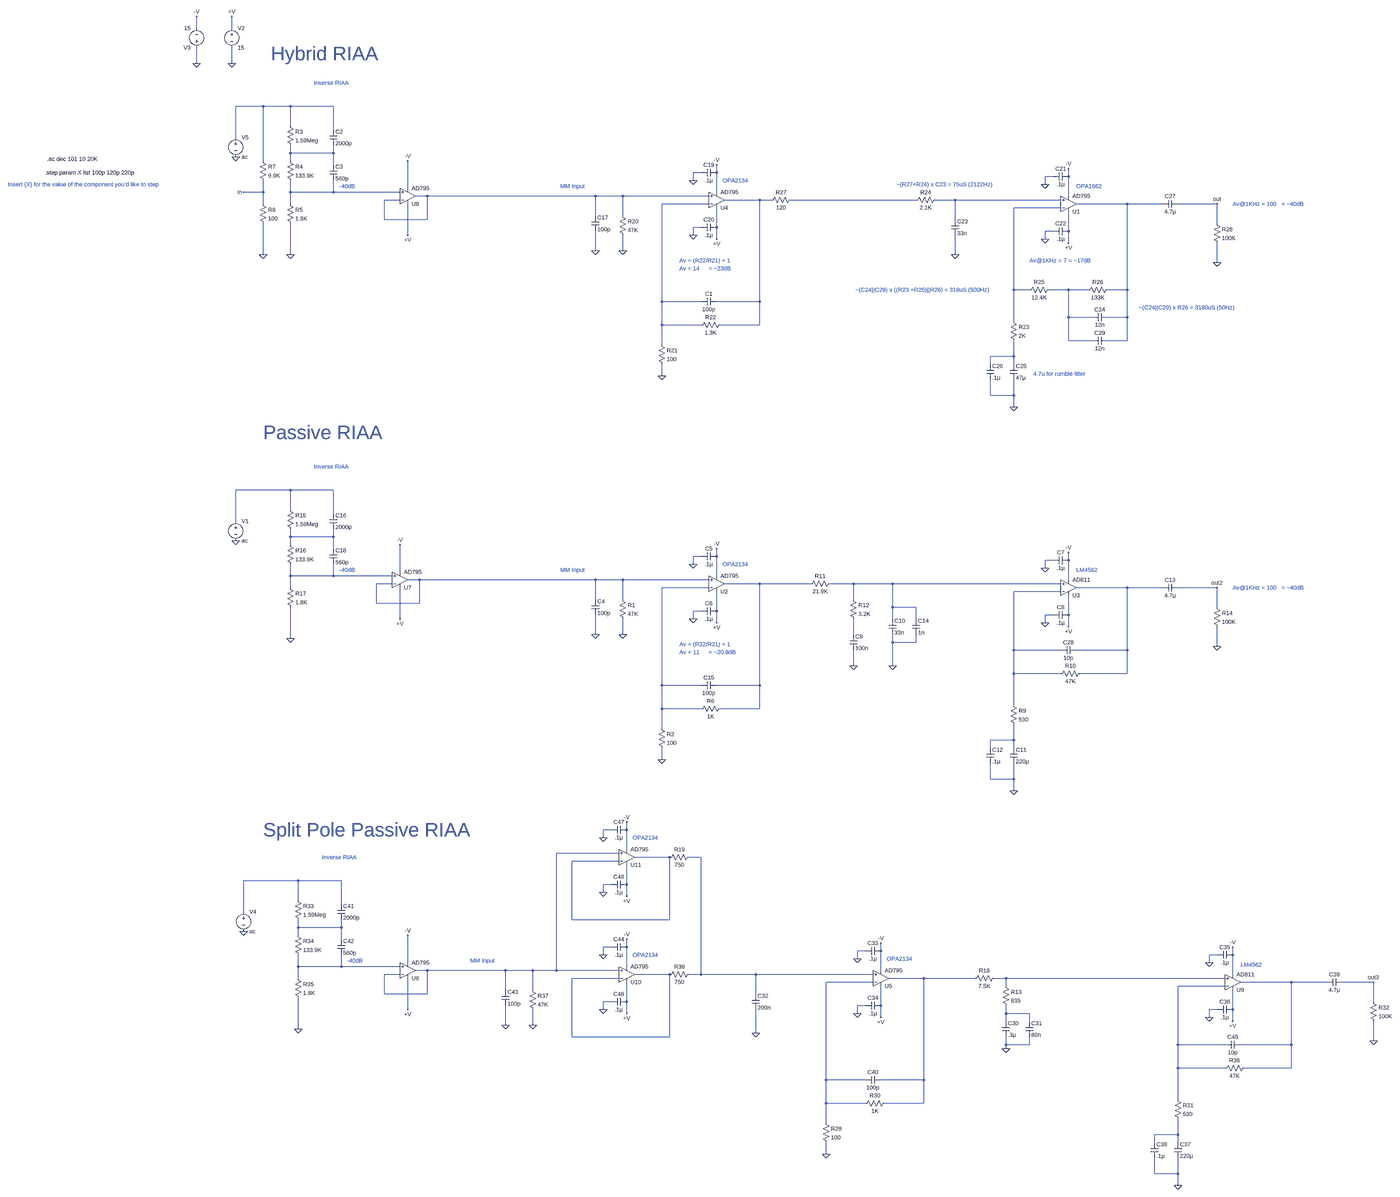
[diagram p0: schematic DIY Phonostage Examples 2.asc, whole sheet]
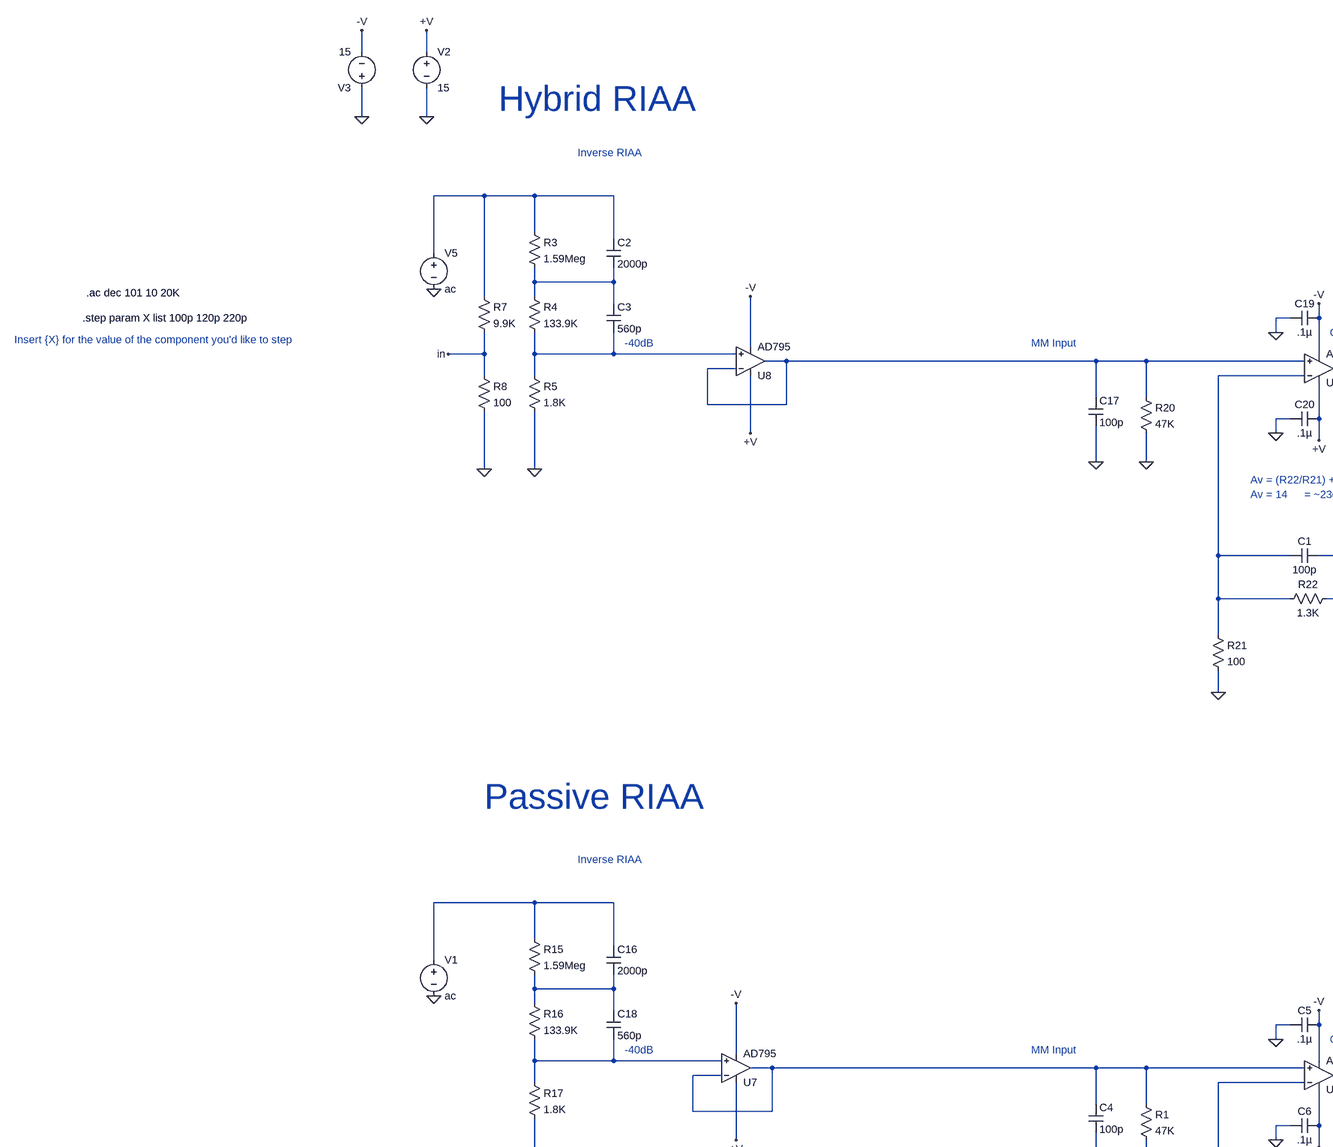
[diagram p1: schematic DIY Phonostage Examples 2.asc, part, row 1 of 2, column 1 of 2]
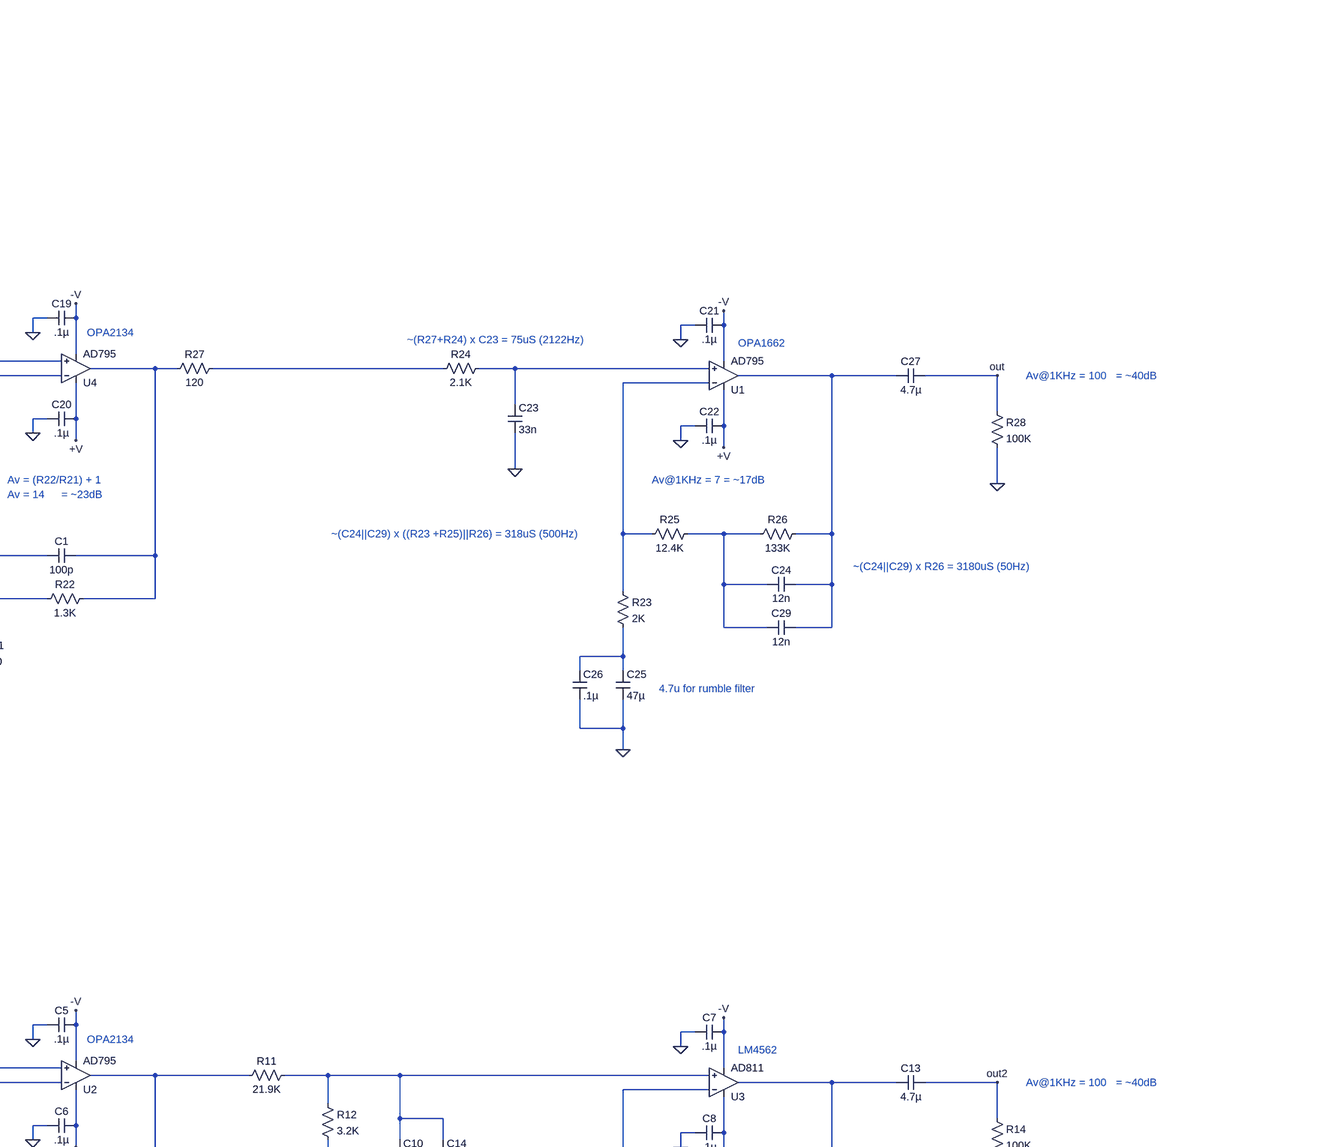
[diagram p2: schematic DIY Phonostage Examples 2.asc, part, row 1 of 2, column 2 of 2]
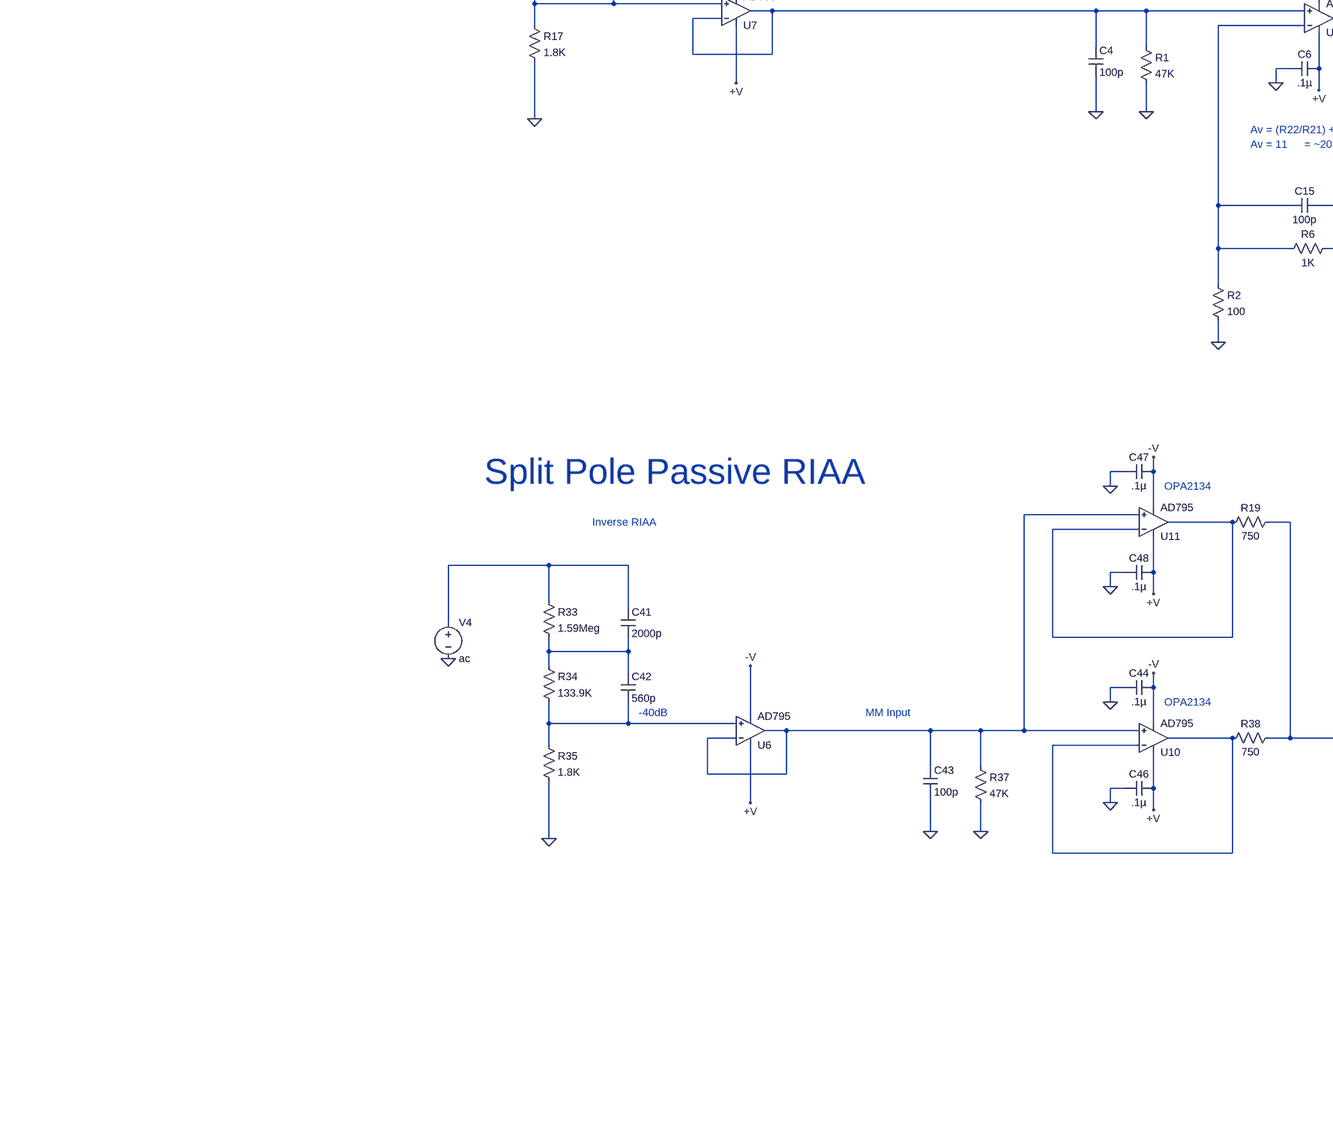
[diagram p3: schematic DIY Phonostage Examples 2.asc, part, row 2 of 2, column 1 of 2]
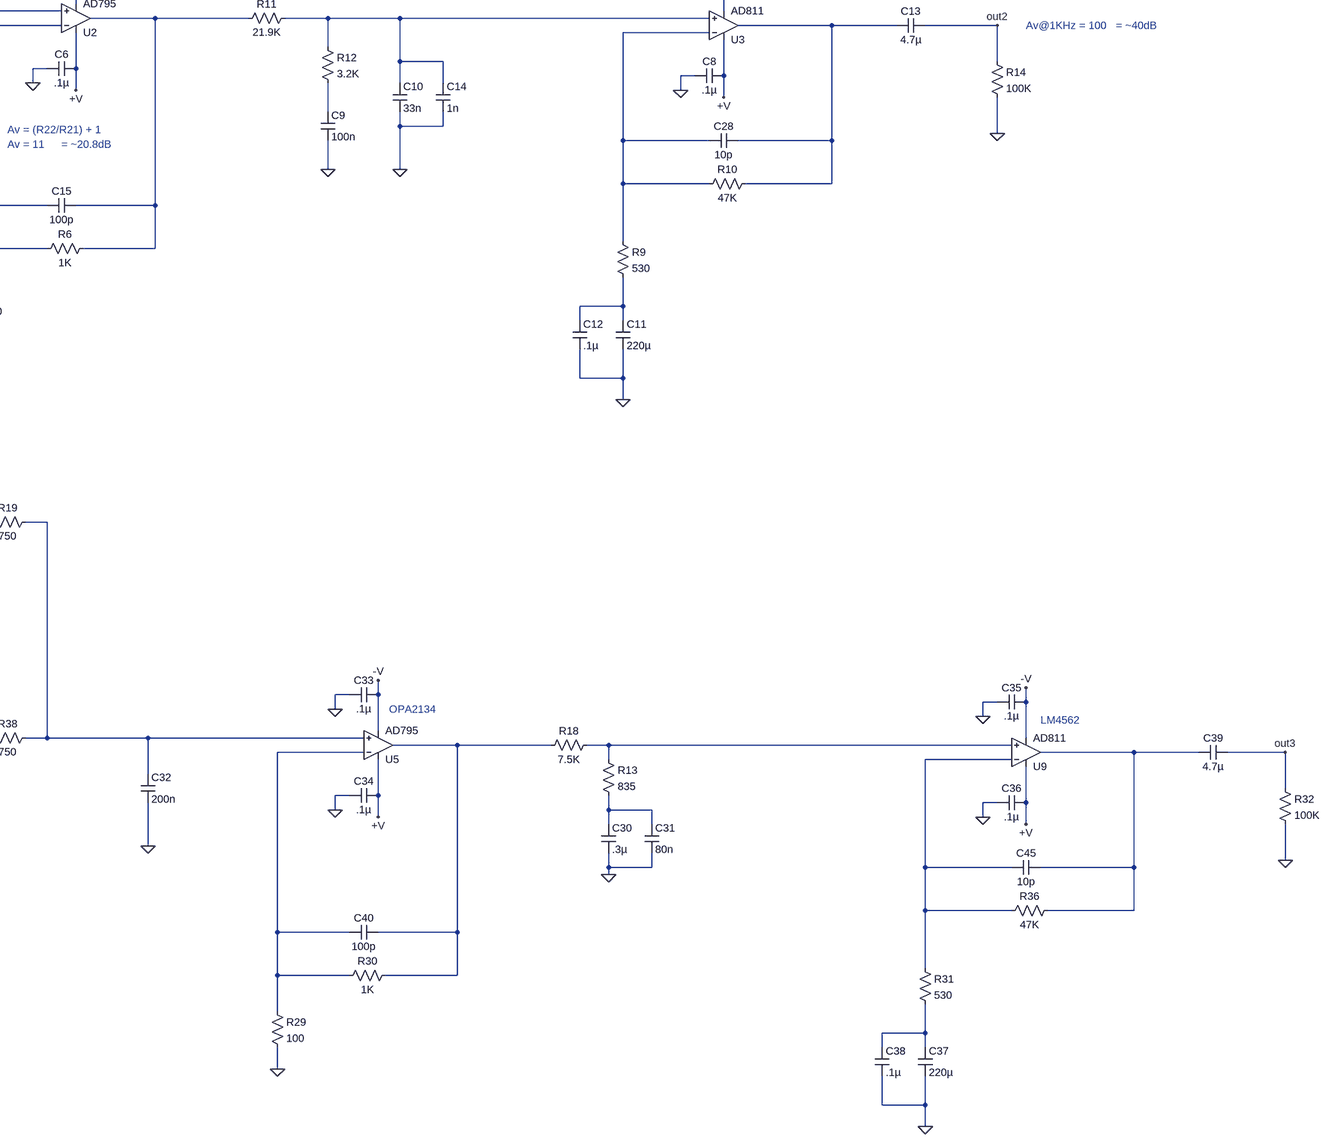
[diagram p4: schematic DIY Phonostage Examples 2.asc, part, row 2 of 2, column 2 of 2]
DIY Phonostage Examples 2.asc, the LTspice schematic file:
Version 4
SHEET 1 5012 5172
WIRE 80 -672 80 -720
WIRE 224 -672 224 -720
WIRE 80 -528 80 -592
WIRE 224 -528 224 -592
WIRE 352 -352 240 -352
WIRE 464 -352 352 -352
WIRE 640 -352 464 -352
WIRE 464 -272 464 -352
WIRE 640 -256 640 -352
WIRE 240 -224 240 -352
WIRE 464 -160 464 -192
WIRE 640 -160 640 -192
WIRE 640 -160 464 -160
WIRE 352 -128 352 -352
WIRE 464 -128 464 -160
WIRE 640 -112 640 -160
WIRE 2144 -80 2112 -80
WIRE 2208 -80 2208 -112
WIRE 3584 -64 3552 -64
WIRE 3648 -64 3648 -96
WIRE 2112 -48 2112 -80
WIRE 3552 -32 3552 -64
WIRE 944 -16 944 -128
WIRE 352 0 352 -48
WIRE 352 0 272 0
WIRE 464 0 464 -48
WIRE 640 0 640 -48
WIRE 640 0 464 0
WIRE 912 0 640 0
WIRE 2208 0 2208 -80
WIRE 1024 16 976 16
WIRE 1712 16 1024 16
WIRE 1824 16 1712 16
WIRE 2176 16 1824 16
WIRE 3648 16 3648 -64
WIRE 912 32 848 32
WIRE 2384 32 2240 32
WIRE 2432 32 2384 32
WIRE 3024 32 2512 32
WIRE 3184 32 3104 32
WIRE 3616 32 3184 32
WIRE 352 48 352 0
WIRE 464 48 464 0
WIRE 2176 48 1984 48
WIRE 3888 48 3680 48
WIRE 4032 48 3888 48
WIRE 4256 48 4096 48
WIRE 3616 64 3424 64
WIRE 1712 96 1712 16
WIRE 1824 96 1824 16
WIRE 848 112 848 32
WIRE 1024 112 1024 16
WIRE 1024 112 848 112
WIRE 3184 112 3184 32
WIRE 4256 128 4256 48
WIRE 2144 144 2112 144
WIRE 2208 144 2208 64
WIRE 3584 160 3552 160
WIRE 3648 160 3648 80
WIRE 944 176 944 48
WIRE 2112 176 2112 144
WIRE 2208 192 2208 144
WIRE 3552 192 3552 160
WIRE 3648 208 3648 160
WIRE 1712 240 1712 160
WIRE 1824 240 1824 176
WIRE 352 256 352 128
WIRE 464 256 464 128
WIRE 3184 256 3184 176
WIRE 4256 288 4256 208
WIRE 3424 400 3424 64
WIRE 3488 400 3424 400
WIRE 3648 400 3568 400
WIRE 3728 400 3648 400
WIRE 3888 400 3888 48
WIRE 3888 400 3808 400
WIRE 1984 448 1984 48
WIRE 2144 448 1984 448
WIRE 2384 448 2384 32
WIRE 2384 448 2208 448
WIRE 3648 512 3648 400
WIRE 3744 512 3648 512
WIRE 3888 512 3888 400
WIRE 3888 512 3808 512
WIRE 3424 528 3424 400
WIRE 1984 544 1984 448
WIRE 2144 544 1984 544
WIRE 2384 544 2384 448
WIRE 2384 544 2224 544
WIRE 3648 608 3648 512
WIRE 3744 608 3648 608
WIRE 3888 608 3888 512
WIRE 3888 608 3808 608
WIRE 1984 624 1984 544
WIRE 3424 672 3424 608
WIRE 3424 672 3328 672
WIRE 3328 704 3328 672
WIRE 3424 704 3424 672
WIRE 1984 752 1984 704
WIRE 3328 832 3328 768
WIRE 3424 832 3424 768
WIRE 3424 832 3328 832
WIRE 3424 880 3424 832
WIRE 464 1248 240 1248
WIRE 640 1248 464 1248
WIRE 464 1328 464 1248
WIRE 640 1344 640 1248
WIRE 240 1376 240 1248
WIRE 464 1440 464 1408
WIRE 640 1440 640 1408
WIRE 640 1440 464 1440
WIRE 464 1472 464 1440
WIRE 640 1488 640 1440
WIRE 2144 1520 2112 1520
WIRE 2208 1520 2208 1488
WIRE 3584 1536 3552 1536
WIRE 3648 1536 3648 1504
WIRE 2112 1552 2112 1520
WIRE 3552 1568 3552 1536
WIRE 912 1584 912 1472
WIRE 464 1600 464 1552
WIRE 640 1600 640 1552
WIRE 640 1600 464 1600
WIRE 880 1600 640 1600
WIRE 2208 1600 2208 1520
WIRE 992 1616 944 1616
WIRE 1712 1616 992 1616
WIRE 1824 1616 1712 1616
WIRE 2176 1616 1824 1616
WIRE 3648 1616 3648 1536
WIRE 880 1632 816 1632
WIRE 2384 1632 2240 1632
WIRE 2592 1632 2384 1632
WIRE 2768 1632 2672 1632
WIRE 2928 1632 2768 1632
WIRE 3616 1632 2928 1632
WIRE 464 1648 464 1600
WIRE 2176 1648 1984 1648
WIRE 3888 1648 3680 1648
WIRE 4032 1648 3888 1648
WIRE 4256 1648 4096 1648
WIRE 3616 1664 3424 1664
WIRE 1712 1696 1712 1616
WIRE 1824 1696 1824 1616
WIRE 2768 1696 2768 1632
WIRE 816 1712 816 1632
WIRE 992 1712 992 1616
WIRE 992 1712 816 1712
WIRE 2928 1728 2928 1632
WIRE 3024 1728 2928 1728
WIRE 4256 1728 4256 1648
WIRE 2144 1744 2112 1744
WIRE 2208 1744 2208 1664
WIRE 3584 1760 3552 1760
WIRE 3648 1760 3648 1680
WIRE 912 1776 912 1648
WIRE 2112 1776 2112 1744
WIRE 2928 1776 2928 1728
WIRE 3024 1776 3024 1728
WIRE 2208 1792 2208 1744
WIRE 3552 1792 3552 1760
WIRE 3648 1808 3648 1760
WIRE 1712 1840 1712 1760
WIRE 1824 1840 1824 1776
WIRE 2768 1840 2768 1776
WIRE 464 1856 464 1728
WIRE 2928 1872 2928 1840
WIRE 3024 1872 3024 1840
WIRE 3024 1872 2928 1872
WIRE 4256 1888 4256 1808
WIRE 3424 1904 3424 1664
WIRE 3616 1904 3424 1904
WIRE 3888 1904 3888 1648
WIRE 3888 1904 3680 1904
WIRE 2768 1968 2768 1904
WIRE 2928 1968 2928 1872
WIRE 3424 2000 3424 1904
WIRE 3616 2000 3424 2000
WIRE 3888 2000 3888 1904
WIRE 3888 2000 3696 2000
WIRE 1984 2048 1984 1648
WIRE 2144 2048 1984 2048
WIRE 2384 2048 2384 1632
WIRE 2384 2048 2208 2048
WIRE 3424 2128 3424 2000
WIRE 1984 2144 1984 2048
WIRE 2144 2144 1984 2144
WIRE 2384 2144 2384 2048
WIRE 2384 2144 2224 2144
WIRE 1984 2224 1984 2144
WIRE 3424 2272 3424 2208
WIRE 3424 2272 3328 2272
WIRE 3328 2304 3328 2272
WIRE 3424 2304 3424 2272
WIRE 1984 2352 1984 2304
WIRE 3328 2432 3328 2368
WIRE 3424 2432 3424 2368
WIRE 3424 2432 3328 2432
WIRE 3424 2480 3424 2432
WIRE 1776 2640 1744 2640
WIRE 1840 2640 1840 2608
WIRE 1744 2672 1744 2640
WIRE 1840 2720 1840 2640
WIRE 1808 2736 1552 2736
WIRE 2016 2752 1872 2752
WIRE 2144 2752 2096 2752
WIRE 1808 2768 1616 2768
WIRE 496 2848 272 2848
WIRE 672 2848 496 2848
WIRE 1776 2864 1744 2864
WIRE 1840 2864 1840 2784
WIRE 1744 2896 1744 2864
WIRE 1840 2912 1840 2864
WIRE 496 2928 496 2848
WIRE 672 2944 672 2848
WIRE 272 2976 272 2848
WIRE 1616 3008 1616 2768
WIRE 2016 3008 2016 2752
WIRE 2016 3008 1616 3008
WIRE 496 3040 496 3008
WIRE 672 3040 672 3008
WIRE 672 3040 496 3040
WIRE 496 3072 496 3040
WIRE 672 3088 672 3040
WIRE 1776 3120 1744 3120
WIRE 1840 3120 1840 3088
WIRE 2816 3136 2784 3136
WIRE 2880 3136 2880 3104
WIRE 1744 3152 1744 3120
WIRE 4256 3152 4224 3152
WIRE 4320 3152 4320 3120
WIRE 2784 3168 2784 3136
WIRE 944 3184 944 3072
WIRE 4224 3184 4224 3152
WIRE 496 3200 496 3152
WIRE 672 3200 672 3152
WIRE 672 3200 496 3200
WIRE 912 3200 672 3200
WIRE 1840 3200 1840 3120
WIRE 1024 3216 976 3216
WIRE 1344 3216 1024 3216
WIRE 1456 3216 1344 3216
WIRE 1552 3216 1552 2736
WIRE 1552 3216 1456 3216
WIRE 1808 3216 1552 3216
WIRE 2880 3216 2880 3136
WIRE 912 3232 848 3232
WIRE 2016 3232 1872 3232
WIRE 2144 3232 2144 2752
WIRE 2144 3232 2096 3232
WIRE 2368 3232 2144 3232
WIRE 2848 3232 2368 3232
WIRE 4320 3232 4320 3152
WIRE 496 3248 496 3200
WIRE 1808 3248 1616 3248
WIRE 3056 3248 2912 3248
WIRE 3264 3248 3056 3248
WIRE 3392 3248 3344 3248
WIRE 4288 3248 3392 3248
WIRE 2848 3264 2656 3264
WIRE 4560 3264 4352 3264
WIRE 4704 3264 4560 3264
WIRE 4928 3264 4768 3264
WIRE 3392 3280 3392 3248
WIRE 4288 3280 4096 3280
WIRE 1344 3296 1344 3216
WIRE 1456 3296 1456 3216
WIRE 848 3312 848 3232
WIRE 1024 3312 1024 3216
WIRE 1024 3312 848 3312
WIRE 2368 3312 2368 3232
WIRE 1776 3344 1744 3344
WIRE 1840 3344 1840 3264
WIRE 4928 3344 4928 3264
WIRE 2816 3360 2784 3360
WIRE 2880 3360 2880 3280
WIRE 944 3376 944 3248
WIRE 1744 3376 1744 3344
WIRE 4256 3376 4224 3376
WIRE 4320 3376 4320 3296
WIRE 1840 3392 1840 3344
WIRE 2784 3392 2784 3360
WIRE 3392 3392 3392 3360
WIRE 3488 3392 3392 3392
WIRE 2880 3408 2880 3360
WIRE 4224 3408 4224 3376
WIRE 3392 3424 3392 3392
WIRE 3488 3424 3488 3392
WIRE 4320 3424 4320 3376
WIRE 1344 3440 1344 3360
WIRE 1456 3440 1456 3376
WIRE 496 3456 496 3328
WIRE 2368 3472 2368 3376
WIRE 1616 3488 1616 3248
WIRE 2016 3488 2016 3232
WIRE 2016 3488 1616 3488
WIRE 4928 3504 4928 3424
WIRE 3392 3520 3392 3488
WIRE 3488 3520 3488 3488
WIRE 3488 3520 3392 3520
WIRE 4096 3520 4096 3280
WIRE 4288 3520 4096 3520
WIRE 4560 3520 4560 3264
WIRE 4560 3520 4352 3520
WIRE 3392 3536 3392 3520
WIRE 4096 3616 4096 3520
WIRE 4288 3616 4096 3616
WIRE 4560 3616 4560 3520
WIRE 4560 3616 4368 3616
WIRE 2656 3664 2656 3264
WIRE 2816 3664 2656 3664
WIRE 3056 3664 3056 3248
WIRE 3056 3664 2880 3664
WIRE 4096 3744 4096 3616
WIRE 2656 3760 2656 3664
WIRE 2816 3760 2656 3760
WIRE 3056 3760 3056 3664
WIRE 3056 3760 2896 3760
WIRE 2656 3840 2656 3760
WIRE 4096 3888 4096 3824
WIRE 4096 3888 4000 3888
WIRE 4000 3920 4000 3888
WIRE 4096 3920 4096 3888
WIRE 2656 3968 2656 3920
WIRE 4000 4048 4000 3984
WIRE 4096 4048 4096 3984
WIRE 4096 4048 4000 4048
WIRE 4096 4096 4096 4048
FLAG 80 -528 0
FLAG 224 -528 0
FLAG 80 -720 -V
FLAG 224 -720 +V
FLAG 1712 240 0
FLAG 1824 240 0
FLAG 2112 -48 0
FLAG 2112 176 0
FLAG 2208 -112 -V
FLAG 2208 192 +V
FLAG 1984 752 0
FLAG 3552 -32 0
FLAG 3552 192 0
FLAG 3648 -96 -V
FLAG 3648 208 +V
FLAG 3184 256 0
FLAG 3424 880 0
FLAG 4256 288 0
FLAG 4256 48 out
FLAG 240 -144 0
FLAG 464 256 0
FLAG 352 256 0
FLAG 272 0 in
FLAG 1712 1840 0
FLAG 1824 1840 0
FLAG 2112 1552 0
FLAG 2112 1776 0
FLAG 2208 1488 -V
FLAG 2208 1792 +V
FLAG 1984 2352 0
FLAG 3552 1568 0
FLAG 3552 1792 0
FLAG 3648 1504 -V
FLAG 3648 1808 +V
FLAG 3424 2480 0
FLAG 4256 1888 0
FLAG 4256 1648 out2
FLAG 240 1456 0
FLAG 464 1856 0
FLAG 2768 1968 0
FLAG 2928 1968 0
FLAG 912 1472 -V
FLAG 912 1776 +V
FLAG 944 -128 -V
FLAG 944 176 +V
FLAG 2784 3168 0
FLAG 2784 3392 0
FLAG 2880 3104 -V
FLAG 2880 3408 +V
FLAG 2656 3968 0
FLAG 4224 3184 0
FLAG 4224 3408 0
FLAG 4320 3120 -V
FLAG 4320 3424 +V
FLAG 4096 4096 0
FLAG 4928 3504 0
FLAG 4928 3264 out3
FLAG 272 3056 0
FLAG 496 3456 0
FLAG 944 3072 -V
FLAG 944 3376 +V
FLAG 3392 3536 0
FLAG 1344 3440 0
FLAG 1456 3440 0
FLAG 1744 3152 0
FLAG 1744 3376 0
FLAG 1840 3088 -V
FLAG 1840 3392 +V
FLAG 2368 3472 0
FLAG 1744 2672 0
FLAG 1744 2896 0
FLAG 1840 2608 -V
FLAG 1840 2912 +V
SYMBOL voltage 224 -688 R0
WINDOW 123 0 0 Left 0
WINDOW 39 0 0 Left 0
SYMATTR InstName V2
SYMATTR Value 15
SYMBOL voltage 80 -576 R180
WINDOW 123 0 0 Left 0
WINDOW 39 0 0 Left 0
SYMATTR InstName V3
SYMATTR Value 15
SYMBOL Opamps\\AD795 2208 96 M180
SYMATTR InstName U4
SYMBOL res 1808 80 R0
SYMATTR InstName R20
SYMATTR Value 47K
SYMBOL cap 1696 96 R0
SYMATTR InstName C17
SYMATTR Value 100p
SYMBOL res 1968 608 R0
SYMATTR InstName R21
SYMATTR Value 100
SYMBOL res 2240 528 R90
WINDOW 0 0 56 VBottom 2
WINDOW 3 32 56 VTop 2
SYMATTR InstName R22
SYMATTR Value 1.3K
SYMBOL cap 2208 -96 R90
WINDOW 0 0 32 VBottom 2
WINDOW 3 32 32 VTop 2
SYMATTR InstName C19
SYMATTR Value .1µ
SYMBOL cap 2208 128 R90
WINDOW 0 0 32 VBottom 2
WINDOW 3 32 32 VTop 2
SYMATTR InstName C20
SYMATTR Value .1µ
SYMBOL res 3408 512 R0
SYMATTR InstName R23
SYMATTR Value 2K
SYMBOL cap 3648 -80 R90
WINDOW 0 0 32 VBottom 2
WINDOW 3 32 32 VTop 2
SYMATTR InstName C21
SYMATTR Value .1µ
SYMBOL cap 3648 144 R90
WINDOW 0 0 32 VBottom 2
WINDOW 3 32 32 VTop 2
SYMATTR InstName C22
SYMATTR Value .1µ
SYMBOL res 3120 16 R90
WINDOW 0 0 56 VBottom 2
WINDOW 3 32 56 VTop 2
SYMATTR InstName R24
SYMATTR Value 2.1K
SYMBOL cap 3168 112 R0
SYMATTR InstName C23
SYMATTR Value 33n
SYMBOL res 3584 384 R90
WINDOW 0 0 56 VBottom 2
WINDOW 3 32 56 VTop 2
SYMATTR InstName R25
SYMATTR Value 12.4K
SYMBOL res 3824 384 R90
WINDOW 0 0 56 VBottom 2
WINDOW 3 32 56 VTop 2
SYMATTR InstName R26
SYMATTR Value 133K
SYMBOL cap 3808 496 R90
WINDOW 0 0 32 VBottom 2
WINDOW 3 32 32 VTop 2
SYMATTR InstName C24
SYMATTR Value 12n
SYMBOL cap 3408 704 R0
SYMATTR InstName C25
SYMATTR Value 47µ
SYMBOL cap 3312 704 R0
SYMATTR InstName C26
SYMATTR Value .1µ
SYMBOL res 2528 16 R90
WINDOW 0 0 56 VBottom 2
WINDOW 3 32 56 VTop 2
SYMATTR InstName R27
SYMATTR Value 120
SYMBOL cap 4096 32 R90
WINDOW 0 0 32 VBottom 2
WINDOW 3 32 32 VTop 2
SYMATTR InstName C27
SYMATTR Value 4.7µ
SYMBOL res 4240 112 R0
SYMATTR InstName R28
SYMATTR Value 100K
SYMBOL cap 3808 592 R90
WINDOW 0 0 32 VBottom 2
WINDOW 3 32 32 VTop 2
SYMATTR InstName C29
SYMATTR Value 12n
SYMBOL Opamps\\AD795 3648 112 M180
SYMATTR InstName U1
SYMBOL cap 2208 432 R90
WINDOW 0 0 32 VBottom 2
WINDOW 3 32 32 VTop 2
SYMATTR InstName C1
SYMATTR Value 100p
SYMBOL res 448 -288 R0
SYMATTR InstName R3
SYMATTR Value 1.59Meg
SYMBOL res 448 -144 R0
SYMATTR InstName R4
SYMATTR Value 133.9K
SYMBOL cap 624 -256 R0
SYMATTR InstName C2
SYMATTR Value 2000p
SYMBOL cap 624 -112 R0
SYMATTR InstName C3
SYMATTR Value 560p
SYMBOL res 448 32 R0
SYMATTR InstName R5
SYMATTR Value 1.8K
SYMBOL res 336 -144 R0
SYMATTR InstName R7
SYMATTR Value 9.9K
SYMBOL res 336 32 R0
SYMATTR InstName R8
SYMATTR Value 100
SYMBOL Opamps\\AD795 2208 1696 M180
SYMATTR InstName U2
SYMBOL res 1808 1680 R0
SYMATTR InstName R1
SYMATTR Value 47K
SYMBOL cap 1696 1696 R0
SYMATTR InstName C4
SYMATTR Value 100p
SYMBOL res 1968 2208 R0
SYMATTR InstName R2
SYMATTR Value 100
SYMBOL res 2240 2128 R90
WINDOW 0 0 56 VBottom 2
WINDOW 3 32 56 VTop 2
SYMATTR InstName R6
SYMATTR Value 1K
SYMBOL cap 2208 1504 R90
WINDOW 0 0 32 VBottom 2
WINDOW 3 32 32 VTop 2
SYMATTR InstName C5
SYMATTR Value .1µ
SYMBOL cap 2208 1728 R90
WINDOW 0 0 32 VBottom 2
WINDOW 3 32 32 VTop 2
SYMATTR InstName C6
SYMATTR Value .1µ
SYMBOL res 3408 2112 R0
SYMATTR InstName R9
SYMATTR Value 530
SYMBOL cap 3648 1520 R90
WINDOW 0 0 32 VBottom 2
WINDOW 3 32 32 VTop 2
SYMATTR InstName C7
SYMATTR Value .1µ
SYMBOL cap 3648 1744 R90
WINDOW 0 0 32 VBottom 2
WINDOW 3 32 32 VTop 2
SYMATTR InstName C8
SYMATTR Value .1µ
SYMBOL cap 3408 2304 R0
SYMATTR InstName C11
SYMATTR Value 220µ
SYMBOL cap 3312 2304 R0
SYMATTR InstName C12
SYMATTR Value .1µ
SYMBOL cap 4096 1632 R90
WINDOW 0 0 32 VBottom 2
WINDOW 3 32 32 VTop 2
SYMATTR InstName C13
SYMATTR Value 4.7µ
SYMBOL res 4240 1712 R0
SYMATTR InstName R14
SYMATTR Value 100K
SYMBOL cap 2208 2032 R90
WINDOW 0 0 32 VBottom 2
WINDOW 3 32 32 VTop 2
SYMATTR InstName C15
SYMATTR Value 100p
SYMBOL res 448 1312 R0
SYMATTR InstName R15
SYMATTR Value 1.59Meg
SYMBOL res 448 1456 R0
SYMATTR InstName R16
SYMATTR Value 133.9K
SYMBOL cap 624 1344 R0
SYMATTR InstName C16
SYMATTR Value 2000p
SYMBOL cap 624 1488 R0
SYMATTR InstName C18
SYMATTR Value 560p
SYMBOL res 448 1632 R0
SYMATTR InstName R17
SYMATTR Value 1.8K
SYMBOL res 3712 1984 R90
WINDOW 0 0 56 VBottom 2
WINDOW 3 32 56 VTop 2
SYMATTR InstName R10
SYMATTR Value 47K
SYMBOL res 2688 1616 R90
WINDOW 0 0 56 VBottom 2
WINDOW 3 32 56 VTop 2
SYMATTR InstName R11
SYMATTR Value 21.9K
SYMBOL res 2752 1680 R0
SYMATTR InstName R12
SYMATTR Value 3.2K
SYMBOL cap 2752 1840 R0
SYMATTR InstName C9
SYMATTR Value 100n
SYMBOL cap 2912 1776 R0
SYMATTR InstName C10
SYMATTR Value 33n
SYMBOL cap 3680 1888 R90
WINDOW 0 0 32 VBottom 2
WINDOW 3 32 32 VTop 2
SYMATTR InstName C28
SYMATTR Value 10p
SYMBOL cap 3008 1776 R0
SYMATTR InstName C14
SYMATTR Value 1n
SYMBOL voltage 240 -240 R0
SYMATTR InstName V5
SYMATTR Value ac
SYMBOL voltage 240 1360 R0
SYMATTR InstName V1
SYMATTR Value ac
SYMBOL Opamps\\AD795 912 1680 M180
SYMATTR InstName U7
SYMBOL Opamps\\AD795 944 80 M180
SYMATTR InstName U8
SYMBOL OpAmps\\AD811 3648 1712 M180
SYMATTR InstName U3
SYMBOL res 3376 3264 R0
SYMATTR InstName R13
SYMATTR Value 835
SYMBOL res 3360 3232 R90
WINDOW 0 0 56 VBottom 2
WINDOW 3 32 56 VTop 2
SYMATTR InstName R18
SYMATTR Value 7.5K
SYMBOL cap 3376 3424 R0
SYMATTR InstName C30
SYMATTR Value .3µ
SYMBOL cap 3472 3424 R0
SYMATTR InstName C31
SYMATTR Value 80n
SYMBOL Opamps\\AD795 2880 3312 M180
SYMATTR InstName U5
SYMBOL res 2640 3824 R0
SYMATTR InstName R29
SYMATTR Value 100
SYMBOL res 2912 3744 R90
WINDOW 0 0 56 VBottom 2
WINDOW 3 32 56 VTop 2
SYMATTR InstName R30
SYMATTR Value 1K
SYMBOL cap 2880 3120 R90
WINDOW 0 0 32 VBottom 2
WINDOW 3 32 32 VTop 2
SYMATTR InstName C33
SYMATTR Value .1µ
SYMBOL cap 2880 3344 R90
WINDOW 0 0 32 VBottom 2
WINDOW 3 32 32 VTop 2
SYMATTR InstName C34
SYMATTR Value .1µ
SYMBOL res 4080 3728 R0
SYMATTR InstName R31
SYMATTR Value 530
SYMBOL cap 4320 3136 R90
WINDOW 0 0 32 VBottom 2
WINDOW 3 32 32 VTop 2
SYMATTR InstName C35
SYMATTR Value .1µ
SYMBOL cap 4320 3360 R90
WINDOW 0 0 32 VBottom 2
WINDOW 3 32 32 VTop 2
SYMATTR InstName C36
SYMATTR Value .1µ
SYMBOL cap 4080 3920 R0
SYMATTR InstName C37
SYMATTR Value 220µ
SYMBOL cap 3984 3920 R0
SYMATTR InstName C38
SYMATTR Value .1µ
SYMBOL cap 4768 3248 R90
WINDOW 0 0 32 VBottom 2
WINDOW 3 32 32 VTop 2
SYMATTR InstName C39
SYMATTR Value 4.7µ
SYMBOL res 4912 3328 R0
SYMATTR InstName R32
SYMATTR Value 100K
SYMBOL cap 2880 3648 R90
WINDOW 0 0 32 VBottom 2
WINDOW 3 32 32 VTop 2
SYMATTR InstName C40
SYMATTR Value 100p
SYMBOL res 480 2912 R0
SYMATTR InstName R33
SYMATTR Value 1.59Meg
SYMBOL res 480 3056 R0
SYMATTR InstName R34
SYMATTR Value 133.9K
SYMBOL cap 656 2944 R0
SYMATTR InstName C41
SYMATTR Value 2000p
SYMBOL cap 656 3088 R0
SYMATTR InstName C42
SYMATTR Value 560p
SYMBOL res 480 3232 R0
SYMATTR InstName R35
SYMATTR Value 1.8K
SYMBOL res 4384 3600 R90
WINDOW 0 0 56 VBottom 2
WINDOW 3 32 56 VTop 2
SYMATTR InstName R36
SYMATTR Value 47K
SYMBOL cap 4352 3504 R90
WINDOW 0 0 32 VBottom 2
WINDOW 3 32 32 VTop 2
SYMATTR InstName C45
SYMATTR Value 10p
SYMBOL voltage 272 2960 R0
SYMATTR InstName V4
SYMATTR Value ac
SYMBOL Opamps\\AD795 944 3280 M180
SYMATTR InstName U6
SYMBOL OpAmps\\AD811 4320 3328 M180
SYMATTR InstName U9
SYMBOL Opamps\\AD795 1840 3296 M180
SYMATTR InstName U10
SYMBOL res 1440 3280 R0
SYMATTR InstName R37
SYMATTR Value 47K
SYMBOL cap 1328 3296 R0
SYMATTR InstName C43
SYMATTR Value 100p
SYMBOL cap 1840 3104 R90
WINDOW 0 0 32 VBottom 2
WINDOW 3 32 32 VTop 2
SYMATTR InstName C44
SYMATTR Value .1µ
SYMBOL cap 1840 3328 R90
WINDOW 0 0 32 VBottom 2
WINDOW 3 32 32 VTop 2
SYMATTR InstName C46
SYMATTR Value .1µ
SYMBOL cap 2352 3312 R0
SYMATTR InstName C32
SYMATTR Value 200n
SYMBOL Opamps\\AD795 1840 2816 M180
SYMATTR InstName U11
SYMBOL cap 1840 2624 R90
WINDOW 0 0 32 VBottom 2
WINDOW 3 32 32 VTop 2
SYMATTR InstName C47
SYMATTR Value .1µ
SYMBOL cap 1840 2848 R90
WINDOW 0 0 32 VBottom 2
WINDOW 3 32 32 VTop 2
SYMATTR InstName C48
SYMATTR Value .1µ
SYMBOL res 2112 2736 R90
WINDOW 0 0 56 VBottom 2
WINDOW 3 32 56 VTop 2
SYMATTR InstName R19
SYMATTR Value 750
SYMBOL res 2112 3216 R90
WINDOW 0 0 56 VBottom 2
WINDOW 3 32 56 VTop 2
SYMATTR InstName R38
SYMATTR Value 750
TEXT -536 -136 Left 2 !.ac dec 101 10 20K
TEXT 1568 -24 Left 2 ;MM Input
TEXT 3504 744 Left 2 ;4.7u for rumble filter
TEXT -544 -80 Left 2 !.step param X list 100p 120p 220p
TEXT 560 -448 Left 2 ;Inverse RIAA
TEXT 664 -24 Left 2 ;-40dB
TEXT 2056 280 Left 2 ;Av = (R22/R21) + 1
TEXT 2056 312 Left 2 ;Av = 14
TEXT 2176 312 Left 2 ;= ~23dB
TEXT 3488 280 Left 2 ;Av@1KHz = 7
TEXT 3648 280 Left 2 ;= ~17dB
TEXT 4320 48 Left 2 ;Av@1KHz = 100
TEXT 4520 48 Left 2 ;= ~40dB
TEXT 3680 -24 Left 2 ;OPA1662
TEXT 2232 -48 Left 2 ;OPA2134
TEXT 2944 -32 Left 2 ;~(R27+R24) x C23 = 75uS (2122Hz)
TEXT 3936 472 Left 2 ;~(C24||C29) x R26 = 3180uS (50Hz)
TEXT 2776 400 Left 2 ;~(C24||C29) x ((R23 +R25)||R26) = 318uS (500Hz)
TEXT 1568 1576 Left 2 ;MM Input
TEXT 560 1152 Left 2 ;Inverse RIAA
TEXT 664 1576 Left 2 ;-40dB
TEXT 2056 1880 Left 2 ;Av = (R22/R21) + 1
TEXT 2056 1912 Left 2 ;Av = 11
TEXT 2176 1912 Left 2 ;= ~20.8dB
TEXT 4320 1648 Left 2 ;Av@1KHz = 100
TEXT 4520 1648 Left 2 ;= ~40dB
TEXT 3680 1576 Left 2 ;LM4562
TEXT 2232 1552 Left 2 ;OPA2134
TEXT 592 2752 Left 2 ;Inverse RIAA
TEXT 696 3176 Left 2 ;-40dB
TEXT 4352 3192 Left 2 ;LM4562
TEXT 2904 3168 Left 2 ;OPA2134
TEXT 1200 3176 Left 2 ;MM Input
TEXT 1864 3152 Left 2 ;OPA2134
TEXT 384 -568 Left 6 ;Hybrid RIAA
TEXT 352 984 Left 6 ;Passive RIAA
TEXT 352 2640 Left 6 ;Split Pole Passive RIAA
TEXT 1864 2672 Left 2 ;OPA2134
TEXT -696 -32 Left 2 ;Insert {X} for the value of the component you'd like to step

The netlist it stands for:
* DIY Phonostage Examples 2.asc
V2 +V 0 15
V3 0 -V 15
XU4 N004 N008 +V -V N005 AD795  ; pins In+ In- V+ V- OUT
R20 N004 0 47K
C17 N004 0 100p
R21 N008 0 100
R22 N005 N008 1.3K
C19 -V 0 .1µ
C20 +V 0 .1µ
R23 N010 N012 2K
C21 -V 0 .1µ
C22 +V 0 .1µ
R24 N007 N006 2.1K
C23 N007 0 33n
R25 N011 N010 12.4K
R26 N009 N011 133K
C24 N009 N011 12n
C25 N012 0 47µ
C26 N012 0 .1µ
R27 N006 N005 120
C27 out N009 4.7µ
R28 out 0 100K
C29 N009 N011 12n
XU1 N007 N010 +V -V N009 AD795  ; pins In+ In- V+ V- OUT
C1 N005 N008 100p
R3 N001 N002 1.59Meg
R4 N002 N003 133.9K
C2 N001 N002 2000p
C3 N002 N003 560p
R5 N003 0 1.8K
R7 N001 in 9.9K
R8 in 0 100
XU2 N016 N019 +V -V N017 AD795  ; pins In+ In- V+ V- OUT
R1 N016 0 47K
C4 N016 0 100p
R2 N019 0 100
R6 N017 N019 1K
C5 -V 0 .1µ
C6 +V 0 .1µ
R9 N021 N023 530
C7 -V 0 .1µ
C8 +V 0 .1µ
C11 N023 0 220µ
C12 N023 0 .1µ
C13 out2 N020 4.7µ
R14 out2 0 100K
C15 N017 N019 100p
R15 N013 N014 1.59Meg
R16 N014 N015 133.9K
C16 N013 N014 2000p
C18 N014 N015 560p
R17 N015 0 1.8K
R10 N020 N021 47K
R11 N018 N017 21.9K
R12 N018 N022 3.2K
C9 N022 0 100n
C10 N018 0 33n
C28 N020 N021 10p
C14 N018 0 1n
V5 N001 0 ac
V1 N013 0 ac
XU7 N015 N016 +V -V N016 AD795  ; pins In+ In- V+ V- OUT
XU8 N003 N004 +V -V N004 AD795  ; pins In+ In- V+ V- OUT
XU3 N018 N021 +V -V N020 AD811  ; pins In+ In- V+ V- OUT
R13 N032 N036 835
R18 N032 N031 7.5K
C30 N036 0 .3µ
C31 N036 0 80n
XU5 N026 N033 +V -V N031 AD795  ; pins In+ In- V+ V- OUT
R29 N033 0 100
R30 N031 N033 1K
C33 -V 0 .1µ
C34 +V 0 .1µ
R31 N035 N037 530
C35 -V 0 .1µ
C36 +V 0 .1µ
C37 N037 0 220µ
C38 N037 0 .1µ
C39 out3 N034 4.7µ
R32 out3 0 100K
C40 N031 N033 100p
R33 N027 N028 1.59Meg
R34 N028 N029 133.9K
C41 N027 N028 2000p
C42 N028 N029 560p
R35 N029 0 1.8K
R36 N034 N035 47K
C45 N034 N035 10p
V4 N027 0 ac
XU6 N029 N024 +V -V N024 AD795  ; pins In+ In- V+ V- OUT
XU9 N032 N035 +V -V N034 AD811  ; pins In+ In- V+ V- OUT
XU10 N024 N030 +V -V N030 AD795  ; pins In+ In- V+ V- OUT
R37 N024 0 47K
C43 N024 0 100p
C44 -V 0 .1µ
C46 +V 0 .1µ
C32 N026 0 200n
XU11 N024 N025 +V -V N025 AD795  ; pins In+ In- V+ V- OUT
C47 -V 0 .1µ
C48 +V 0 .1µ
R19 N026 N025 750
R38 N026 N030 750
.ac dec 101 10 20K
* MM Input
* 4.7u for rumble filter
.step param X list 100p 120p 220p
* Inverse RIAA
* -40dB
* Av = (R22/R21) + 1
* Av = 14
* = ~23dB
* Av@1KHz = 7
* = ~17dB
* Av@1KHz = 100
* = ~40dB
* OPA1662
* OPA2134
* ~(R27+R24) x C23 = 75uS (2122Hz)
* ~(C24||C29) x R26 = 3180uS (50Hz)
* ~(C24||C29) x ((R23 +R25)||R26) = 318uS (500Hz)
* MM Input
* Inverse RIAA
* -40dB
* Av = (R22/R21) + 1
* Av = 11
* = ~20.8dB
* Av@1KHz = 100
* = ~40dB
* LM4562
* OPA2134
* Inverse RIAA
* -40dB
* LM4562
* OPA2134
* MM Input
* OPA2134
* Hybrid RIAA
* Passive RIAA
* Split Pole Passive RIAA
* OPA2134
* Insert {X} for the value of the component you'd like to step
.lib ADI1.lib
.backanno
.end